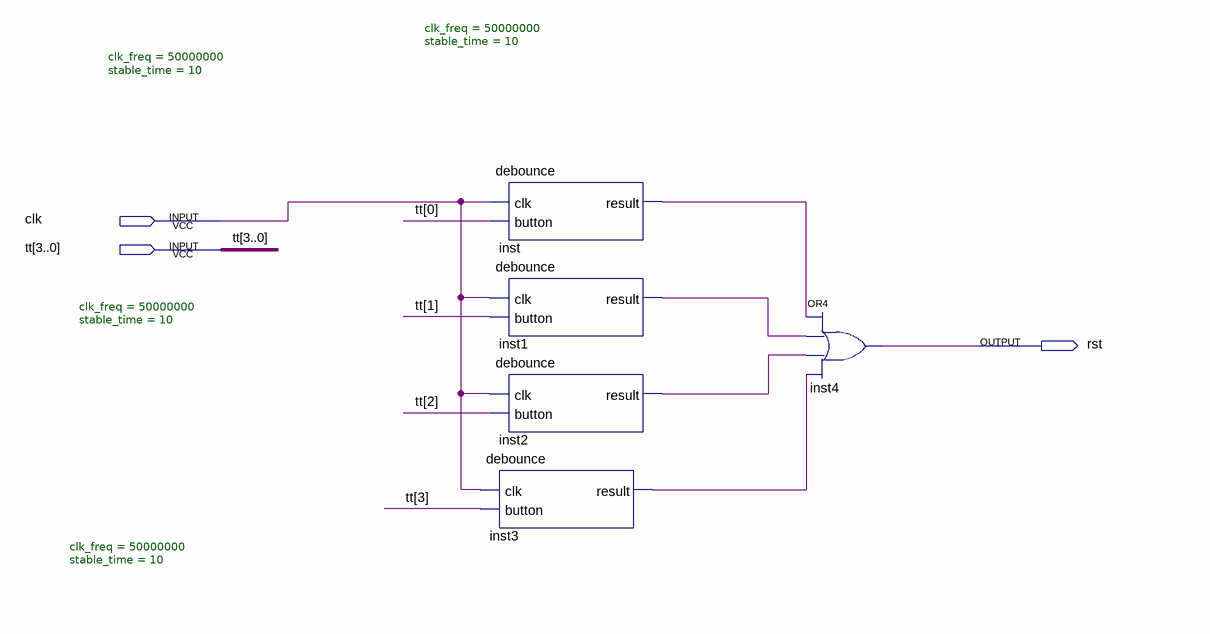
[diagram p0: schematic sheet]
// Quartus schematic rster.bdf as structural Verilog: 5 symbols, 3 pins
module rster (
  input  clk,
  input  [3:0] tt,
  output rst
);

  wire inst1_result, inst2_result, inst3_result, inst_result;

  debounce #(.clk_freq(50000000), .stable_time(10)) inst (.clk(clk), .button(tt[0]), .result(inst_result));
  debounce #(.clk_freq(50000000), .stable_time(10)) inst1 (.clk(clk), .button(tt[1]), .result(inst1_result));
  debounce #(.clk_freq(50000000), .stable_time(10)) inst2 (.clk(clk), .button(tt[2]), .result(inst2_result));
  debounce #(.clk_freq(50000000), .stable_time(10)) inst3 (.clk(clk), .button(tt[3]), .result(inst3_result));
  or inst4 (rst, inst_result, inst1_result, inst2_result, inst3_result);
endmodule
